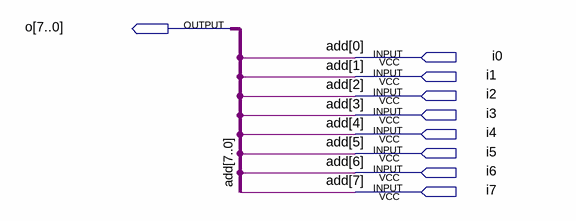
[diagram p0: schematic sheet]
// Quartus schematic vetor7_0_out.bdf as structural Verilog: 0 symbols, 9 pins
module vetor7_0_out (
  input  i0,
  input  i1,
  input  i2,
  input  i3,
  input  i4,
  input  i5,
  input  i6,
  input  i7,
  output [7:0] o
);


  assign o = {i7, i6, i5, i4, i3, i2, i1, i0};

  // Other names for the same wires on the sheet: add[7:0] = {i7, i6, i5, i4, i3, i2, i1, i0}
endmodule
